# EAGLE schematic USBToILDAv1 (EAGLE 9.0.1)
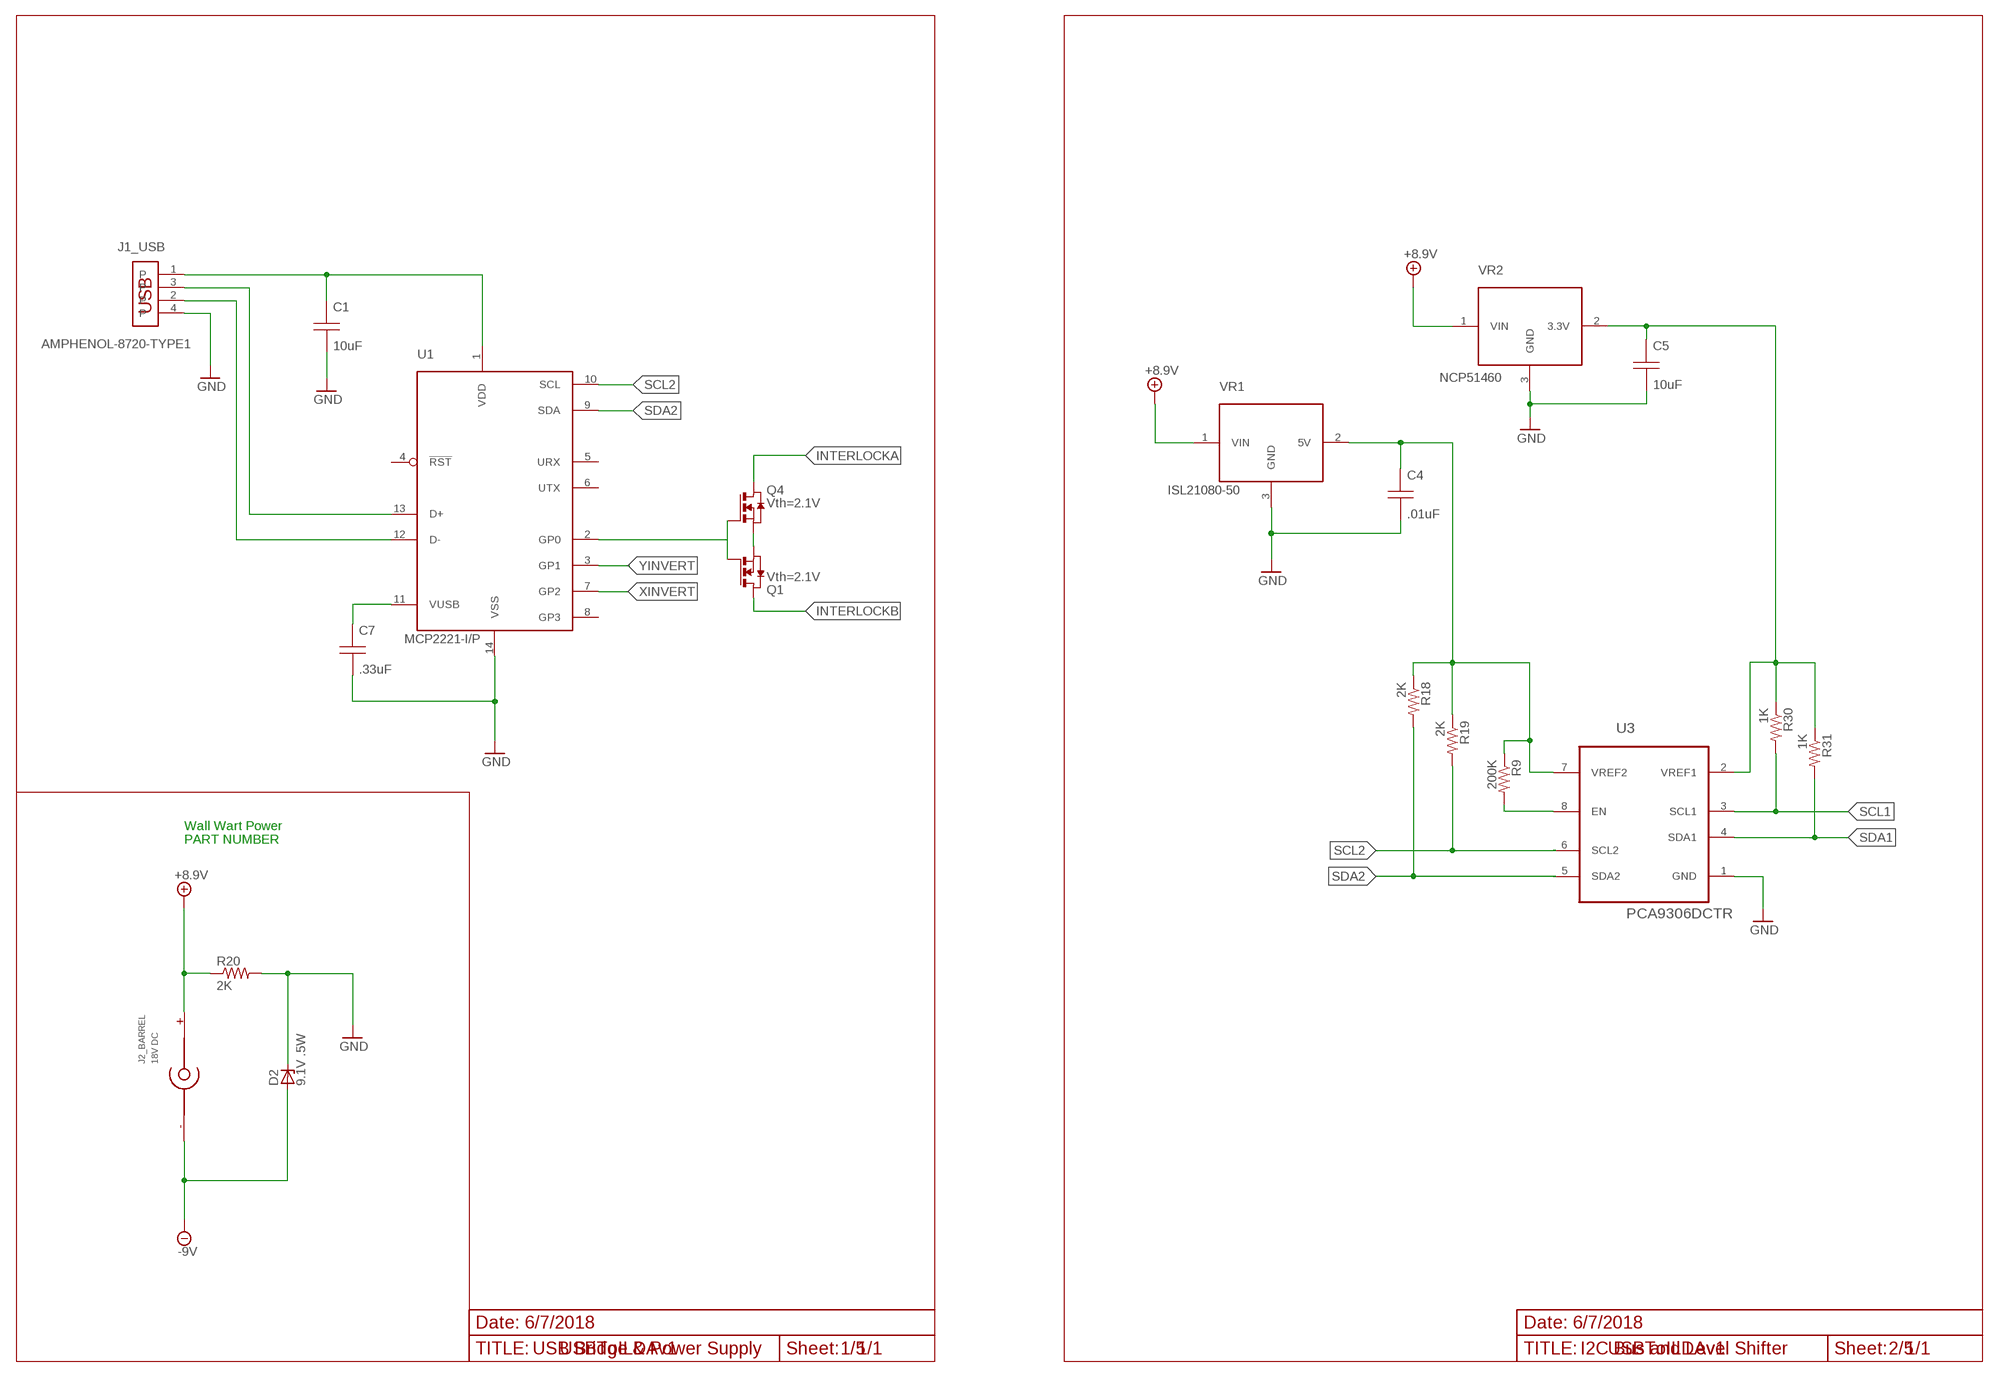
[diagram p0: schematic, sheet 1, part 1 of 3]
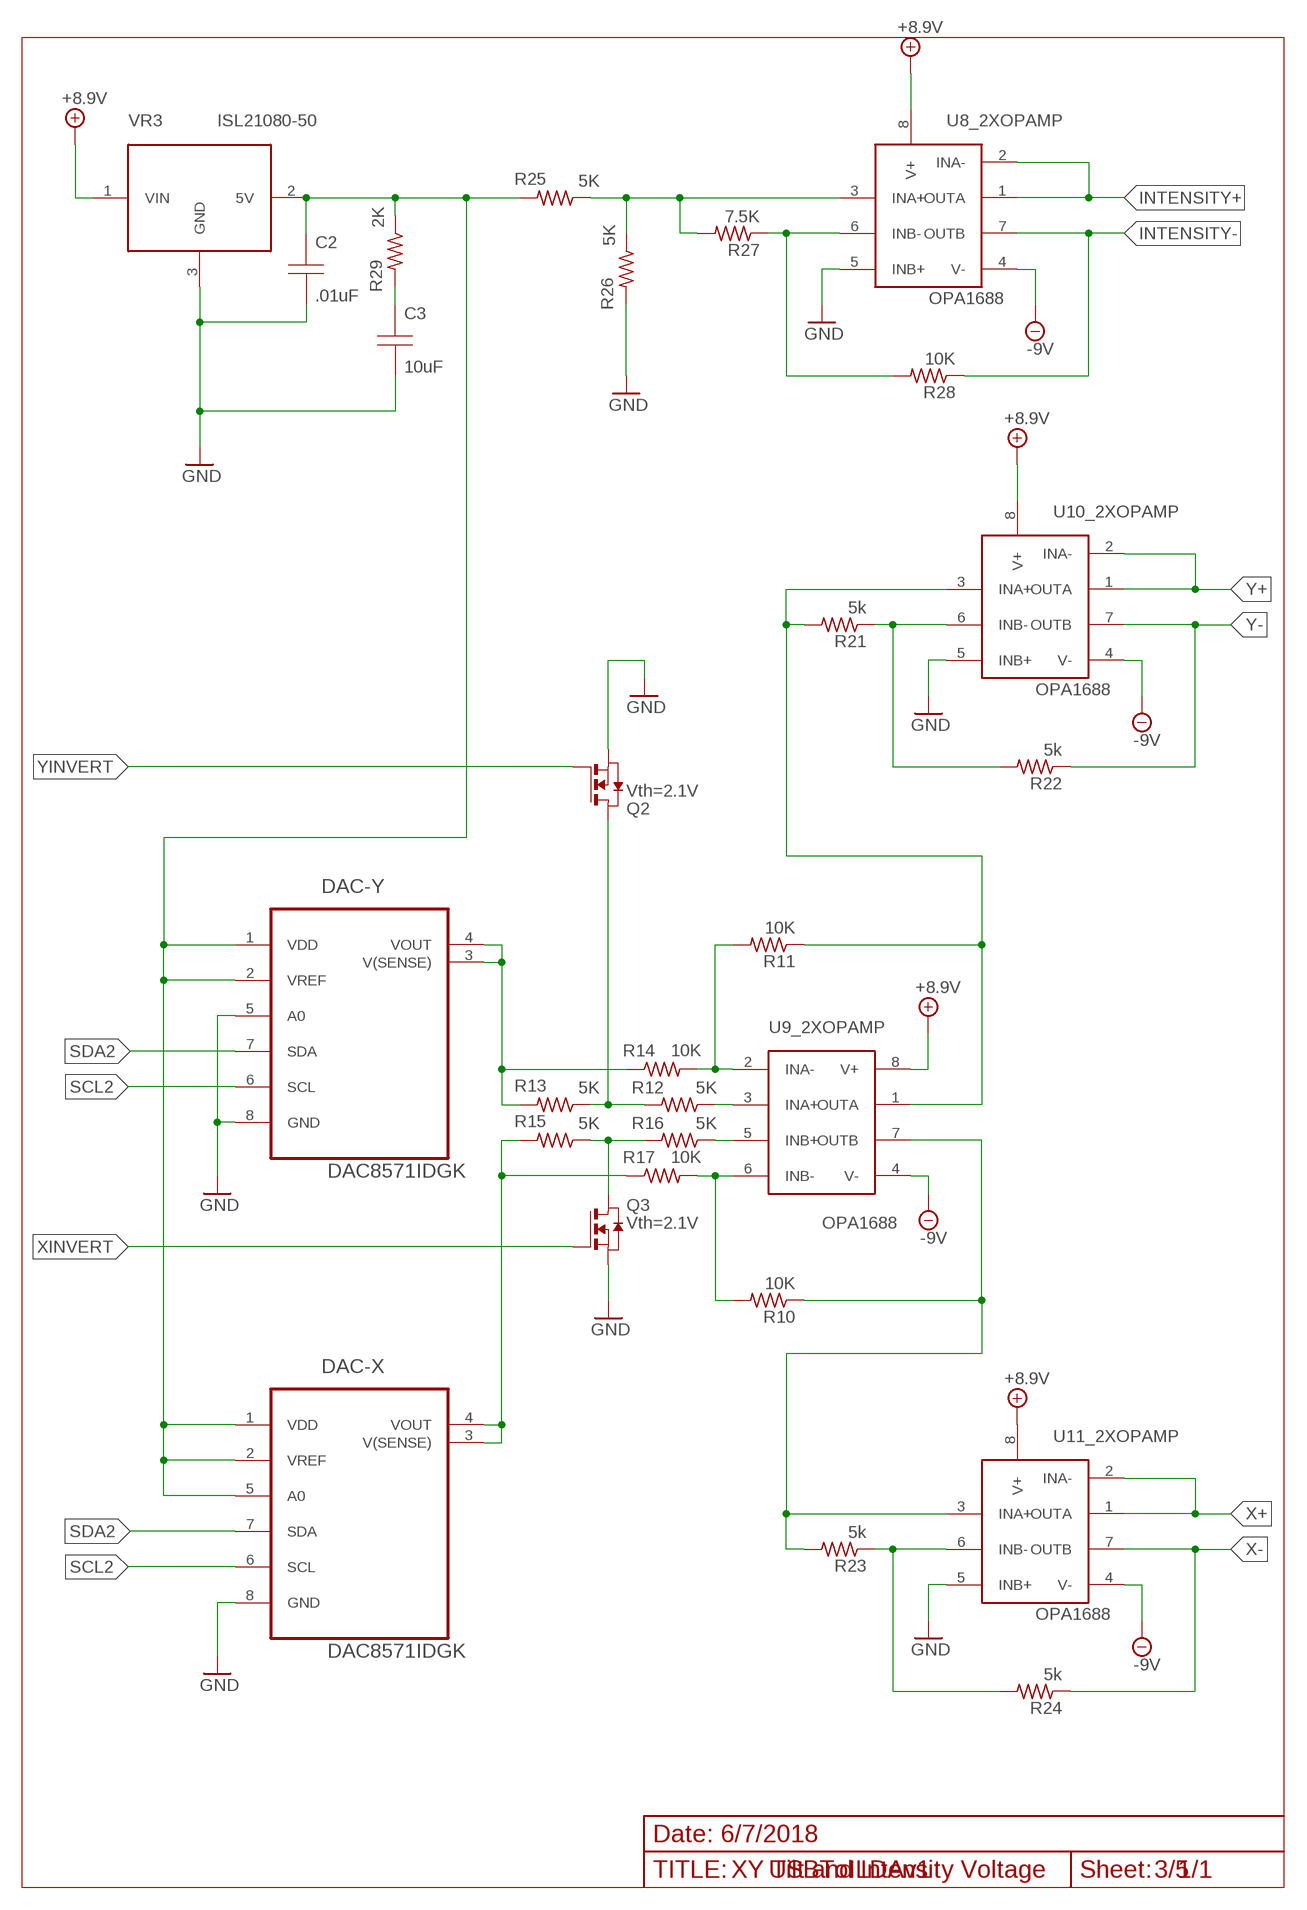
[diagram p1: schematic, sheet 1, part 2 of 3]
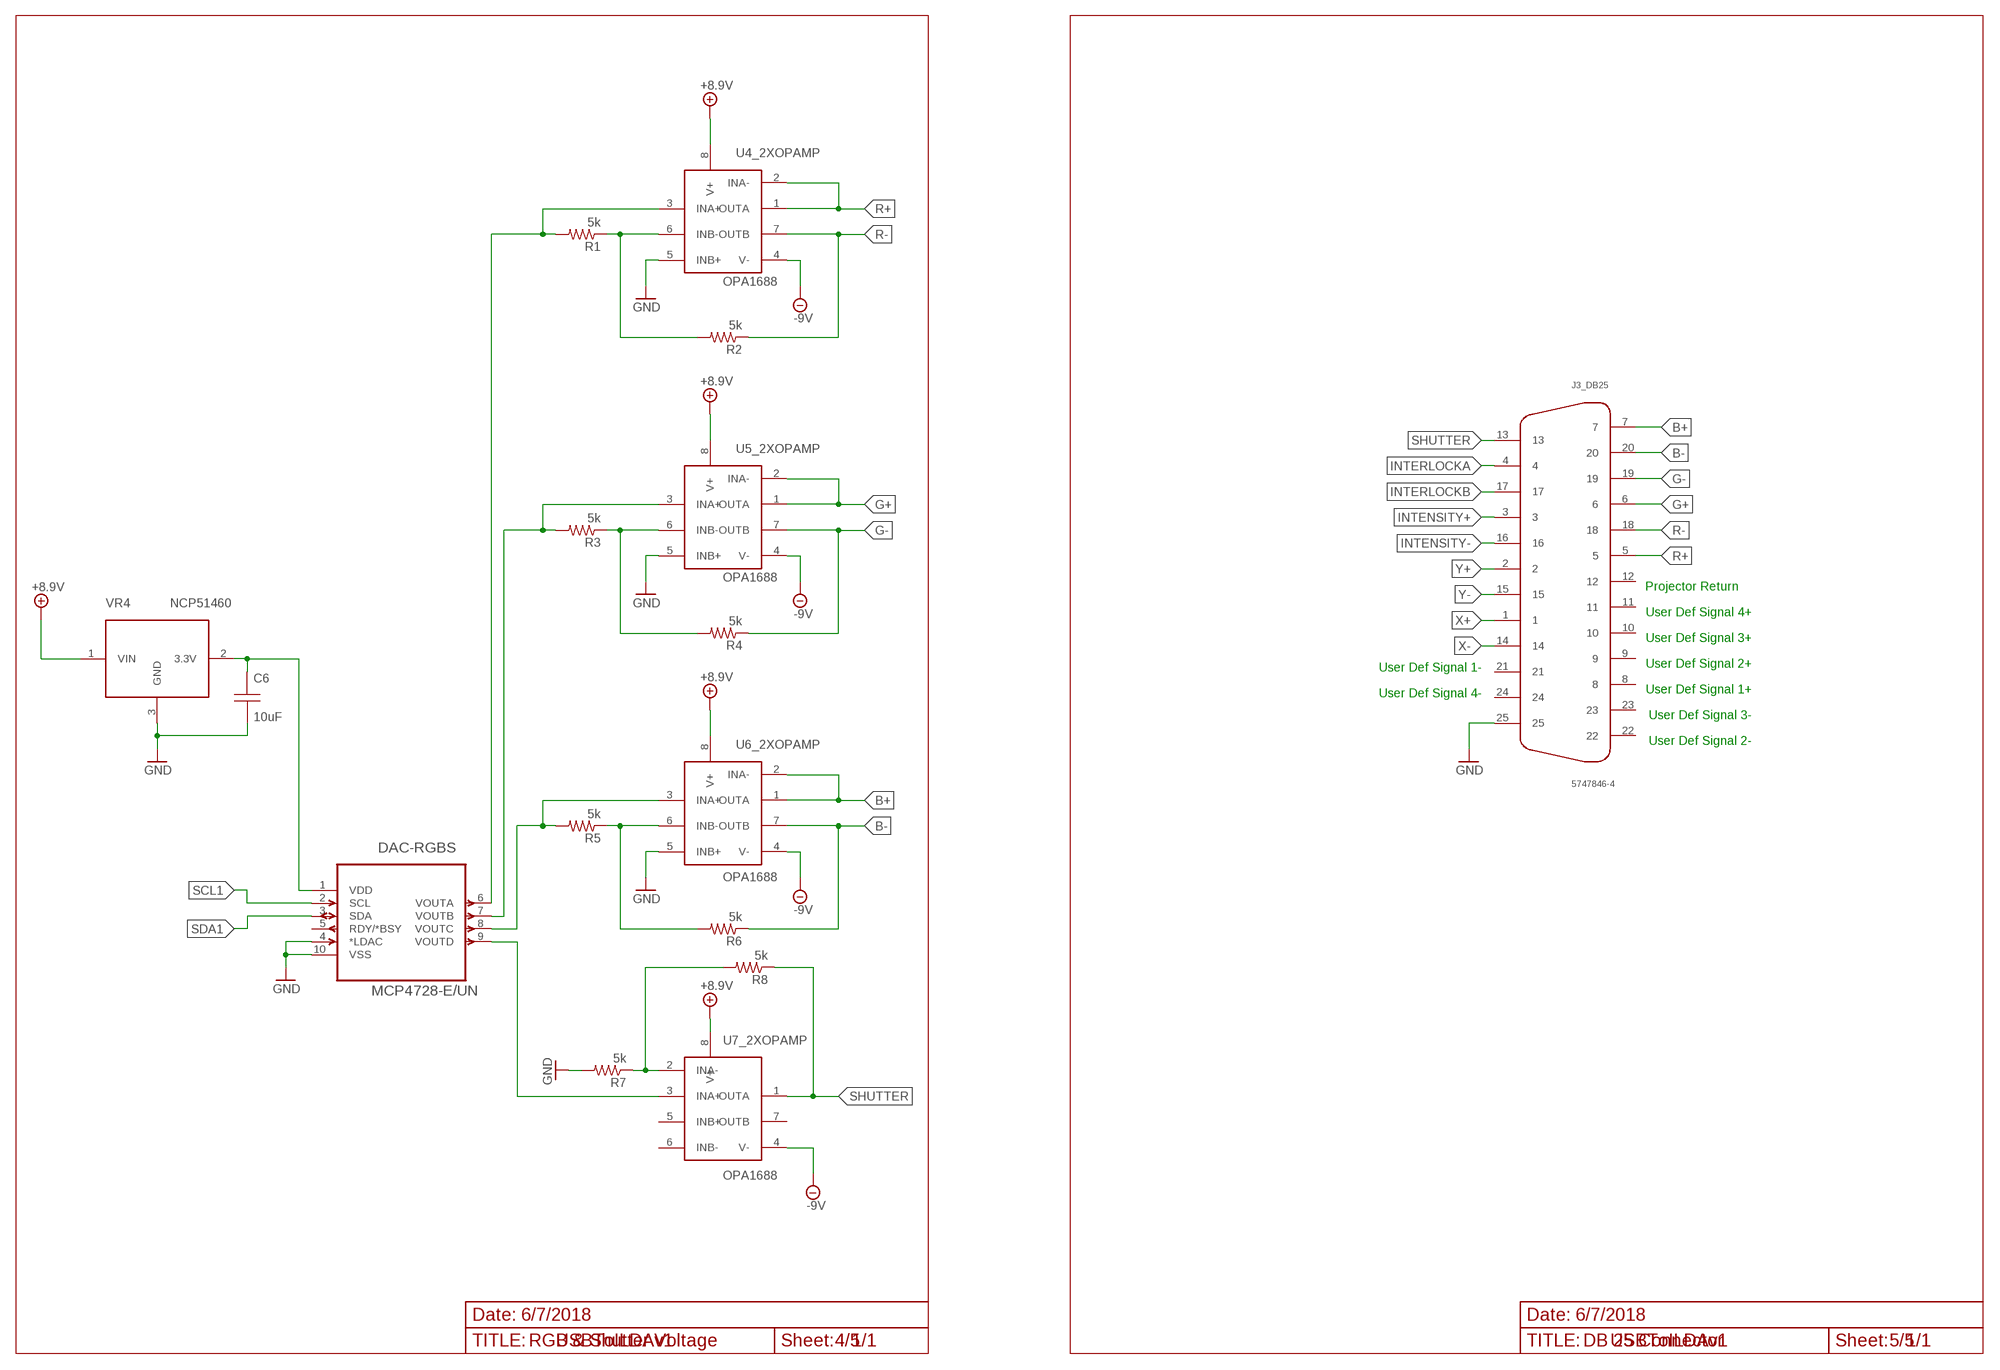
[diagram p2: schematic, sheet 1, part 3 of 3]

## Parts
C1  10uF  RCER71H106MWM1H03A  [WM1]
C2  .01uF  RCER71H106MWM1H03A  [WM1]
C3  10uF  RCER71H106MWM1H03A  [WM1]
C4  .01uF  RCER71H106MWM1H03A  [WM1]
C5  10uF  RCER71H106MWM1H03A  [WM1]
C6  10uF  RCER71H106MWM1H03A  [WM1]
C7  .33uF  RCER71H106MWM1H03A  [WM1]
D2  9.1V .5W  ZPD  [DO35Z10]
DAC-RGBS  MCP4728-E/UN  [SOP50P490X110-10N]
DAC-X  DAC8571IDGK  [SOP65P490X110-8N]
DAC-Y  DAC8571IDGK  [SOP65P490X110-8N]
J1_  AMPHENOL-8720-TYPE1  [87520]
J2_BARREL  18V DC  WSU180-0660  [PJ-036AH-SMT-TR]
J3_  5747846-4  [5747846-4]
Q1  Vth=2.1V  DMN3033LDM  [SOT-26]
Q2  Vth=2.1V  DMN3033LDM  [SOT-26]
Q3  Vth=2.1V  DMN3033LDM  [SOT-26]
Q4  Vth=2.1V  DMN3033LDM  [SOT-26]
R1  5k  R-US_01005  [R01005]
R2  5k  R-US_01005  [R01005]
R3  5k  R-US_01005  [R01005]
R4  5k  R-US_01005  [R01005]
R5  5k  R-US_01005  [R01005]
R6  5k  R-US_01005  [R01005]
R7  5k  R-US_01005  [R01005]
R8  5k  R-US_01005  [R01005]
R9  200K  R-US_01005  [R01005]
R10  10K  R-US_01005  [R01005]
R11  10K  R-US_01005  [R01005]
R12  5K  R-US_01005  [R01005]
R13  5K  R-US_01005  [R01005]
R14  10K  R-US_01005  [R01005]
R15  5K  R-US_01005  [R01005]
R16  5K  R-US_01005  [R01005]
R17  10K  R-US_01005  [R01005]
R18  2K  R-US_01005  [R01005]
R19  2K  R-US_01005  [R01005]
R20  2K  R-US_01005  [R01005]
R21  5k  R-US_01005  [R01005]
R22  5k  R-US_01005  [R01005]
R23  5k  R-US_01005  [R01005]
R24  5k  R-US_01005  [R01005]
R25  5K  R-US_01005  [R01005]
R26  5K  R-US_01005  [R01005]
R27  7.5K  R-US_01005  [R01005]
R28  10K  R-US_01005  [R01005]
R29  2K  R-US_01005  [R01005]
R30  1K  R-US_01005  [R01005]
R31  1K  R-US_01005  [R01005]
U1  MCP2221-I/P  [DIL14]
U3  PCA9306DCTR  [SOP65P400X130-8N]
U4  OPA1688  [SOIC-8]
U5  OPA1688  [SOIC-8]
U6  OPA1688  [SOIC-8]
U7  OPA1688  [SOIC-8]
U8  OPA1688  [SOIC-8]
U9  OPA1688  [SOIC-8]
U10  OPA1688  [SOIC-8]
U11  OPA1688  [SOIC-8]
VR1  ISL21080-50  [SOT23-CASE308]
VR2  NCP51460  [SOT-23-CASE318]
VR3  ISL21080-50  [SOT23-CASE308]
VR4  NCP51460  [SOT-23-CASE318]

## Nets
+8.9V: J2_BARREL.1(+) R20.1 U4.8(8:V+) U5.8(8:V+) U6.8(8:V+) U7.8(8:V+) U8.8(8:V+) U9.8(8:V+) U10.8(8:V+) U11.8(8:V+) VR1.1(VIN) VR2.1(VIN) VR3.1(VIN) VR4.1(VIN)
-9V: D2.A J2_BARREL.2(-) J2_BARREL.3(-) U4.4(4:V-) U5.4(4:V-) U6.4(4:V-) U7.4(4:V-) U8.4(4:V-) U9.4(4:V-) U10.4(4:V-) U11.4(4:V-)
B+: J3_.7 U6.1(1:OUTA) U6.2(2:INA-)
B-: J3_.20 R6.1 U6.7(7:OUTB)
G+: J3_.6 U5.1(1:OUTA) U5.2(2:INA-)
G-: J3_.19 R4.1 U5.7(7:OUTB)
GND: C2.P$2(B) C3.P$2(B) C4.P$2(B) C5.P$2(B) C6.P$2(B) C7.P$2(B) D2.C DAC-RGBS.4(*LDAC) DAC-RGBS.10(VSS) DAC-X.8(GND) DAC-Y.5(A0) DAC-Y.8(GND) J1_.4(4:P) J3_.25 Q2.S Q3.S R7.2 R20.2 R26.2 U1.14(VSS) U3.1(GND) U4.5(5:INB+) U5.5(5:INB+) U6.5(5:INB+) U8.5(5:INB+) U10.5(5:INB+) U11.5(5:INB+) VR1.3(GND) VR2.3(GND) VR3.3(GND) VR4.3(GND)
INTENSITY+: J3_.3 U8.1(1:OUTA) U8.2(2:INA-)
INTENSITY-: J3_.16 R28.1 U8.7(7:OUTB)
INTERLOCK-I/O: Q1.G Q4.G U1.2(GP0)
INTERLOCKA: J3_.4 Q4.D1(D) Q4.D2(D) Q4.D3(D) Q4.D4(D)
INTERLOCKB: J3_.17 Q1.D1(D) Q1.D2(D) Q1.D3(D) Q1.D4(D)
N$1: C1.P$2(B) ; supply symbol labelled GND
N$2: J1_.2(2:P) U1.12(D-)
N$3: J1_.3(3:P) U1.13(D+)
N$4: C1.P$1(A) J1_.1(1:P) U1.1(VDD)
N$5: R9.2 U3.8(EN)
N$6: DAC-RGBS.6(VOUTA) R1.2 U4.3(3:INA+)
N$7: R7.1 R8.2 U7.2(2:INA-)
N$8: R1.1 R2.2 U4.6(6:INB-)
N$9: C6.P$1(A) DAC-RGBS.1(VDD) VR4.2(3.3V)
N$10: DAC-RGBS.7(VOUTB) R3.2 U5.3(3:INA+)
N$11: R25.1 R26.1 R27.2 U8.3(3:INA+)
N$12: R3.1 R4.2 U5.6(6:INB-)
N$13: C2.P$1(A) DAC-X.1(VDD) DAC-X.2(VREF) DAC-X.5(A0) DAC-Y.1(VDD) DAC-Y.2(VREF) R25.2 R29.1 VR3.2(5V)
N$14: DAC-RGBS.8(VOUTC) R5.2 U6.3(3:INA+)
N$15: R11.1 R21.2 U9.1(1:OUTA) U10.3(3:INA+)
N$16: R5.1 R6.2 U6.6(6:INB-)
N$17: C7.P$1(A) U1.11(VUSB)
N$18: DAC-RGBS.9(VOUTD) U7.3(3:INA+)
N$22: C4.P$1(A) R9.1 R18.1 R19.1 U3.7(VREF2) VR1.2(5V)
N$23: Q1.S Q4.S
N$28: R11.2 R14.2 U9.2(2:INA-)
N$30: R12.1 U9.3(3:INA+)
N$31: Q2.D1(D) Q2.D2(D) Q2.D3(D) Q2.D4(D) R12.2 R13.1
N$32: DAC-Y.3(V(SENSE)) DAC-Y.4(VOUT) R13.2 R14.1
N$33: DAC-X.3(V(SENSE)) DAC-X.4(VOUT) R15.2 R17.1
N$35: Q3.D1(D) Q3.D2(D) Q3.D3(D) Q3.D4(D) R15.1 R16.2
N$36: R16.1 U9.5(5:INB+)
N$37: R10.2 R17.2 U9.6(6:INB-)
N$38: R10.1 R23.2 U9.7(7:OUTB) U11.3(3:INA+)
N$43: C3.P$1(A) R29.2
N$45: R21.1 R22.2 U10.6(6:INB-)
N$48: R23.1 R24.2 U11.6(6:INB-)
N$51: R27.1 R28.2 U8.6(6:INB-)
N$54: C5.P$1(A) R30.1 R31.1 U3.2(VREF1) VR2.2(3.3V)
R+: J3_.5 U4.1(1:OUTA) U4.2(2:INA-)
R-: J3_.18 R2.1 U4.7(7:OUTB)
SCL1: DAC-RGBS.2(SCL) R30.2 U3.3(SCL1)
SCL2: DAC-X.6(SCL) DAC-Y.6(SCL) R19.2 U1.10(SCL) U3.6(SCL2)
SDA1: DAC-RGBS.3(SDA) R31.2 U3.4(SDA1)
SDA2: DAC-X.7(SDA) DAC-Y.7(SDA) R18.2 U1.9(SDA) U3.5(SDA2)
SHUTTER: J3_.13 R8.1 U7.1(1:OUTA)
X+: J3_.1 U11.1(1:OUTA) U11.2(2:INA-)
X-: J3_.14 R24.1 U11.7(7:OUTB)
XINVERT: Q3.G U1.7(GP2)
Y+: J3_.2 U10.1(1:OUTA) U10.2(2:INA-)
Y-: J3_.15 R22.1 U10.7(7:OUTB)
YINVERT: Q2.G U1.3(GP1)
Unconnected: DAC-RGBS.5(RDY/*BSY) J3_.8 J3_.9 J3_.10 J3_.11 J3_.12 J3_.21 J3_.22 J3_.23 J3_.24 U1.4(!RST) U1.5(URX) U1.6(UTX) U1.8(GP3) U7.5(5:INB+) U7.6(6:INB-) U7.7(7:OUTB)

## Notes on the sheet
- Projector Return
- User Def Signal 4+
- User Def Signal 3+
- User Def Signal 2+
- User Def Signal 1-
- User Def Signal 1+
- User Def Signal 4-
- User Def Signal 3-
- User Def Signal 2-
- Wall Wart Power 
  PART NUMBER
- 6/7/2018 | 6/7/2018 | 6/7/2018 | 6/7/2018 | 6/7/2018
- USB Bridge & Power Supply | 1/5 | I2C Bus and Level Shifter | 2/5 | XY Tilt and Intensity Voltage | 3/5 | RGB & Shutter Voltage | 4/5 | DB 25 Connector | 5/5

## Library data of the parts
C1-C7 = Capacitors:RCER71H106MWM1H03A
D2 = diode:ZPD: Z DIODE 500 mW
DAC-RGBS = Microchip_By_element14_Batch_1:MCP4728-E/UN: IC, DAC, 12BIT, QUAD; MPN: MCP4728-E/UN; OC_FARNELL: 1800217; OC_NEWARK: 08R1808; PACKAGE: MSOP-10; SUPPLIER: MICROCHIP
DAC-X DAC-Y = Texas Instruments_By_element14_Batch_1:DAC8571IDGK: 0.05ìV/°C max, SINGLE-SUPPLY CMOS OPERATIONAL AMPLIFIERS Zer.-Drift Series; MPN: DAC8571IDGK; OC_FARNELL: -; OC_NEWARK: 20H5068; PACKAGE: MSOP-8; SUPPLIER: Texas Instruments
J1_ = USB Connectors:AMPHENOL-8720-TYPE1
J2_BARREL = CUI:WSU180-0660
J3_ = DB Connectors:5747846-4
Q1-Q4 = DIODES:DMN3033LDM
R1-R31 = resistor:R-US_: RESISTOR, American symbol
U1 = microchip-mcp2221:MCP2221-*: MCP2221 in PDIP, SOIC and TSSOP package The MCP2221 is a USB-to-UART/I2C serial converter which enables USB connectivity in applications that have a UART and I2C interfaces. The device reduces external components by integrating the USB termination resistors and the oscillator needed for USB operation. The MCP2221 also has four GP pins providing miscellaneous functionalities (GPIO, USBCFG, SSPND, Clock Output, ADC, DAC, interrupt detector). Source: www.microchip.com/MCP2221 <http://www.microchip.com/wwwproducts/Devices.aspx?product=MCP2221> and www.microchipdirect.com <http://www.microchipdirect.com/ProductDetails.aspx?Category=MCP2221> Tutorial: MCP2221 by Arnauld Biganzoli <https://docs.google.com/document/d/1P3zzqCKdEXzCe--1Yyg8PClCZKsUri8pyNO7AV2daaw/edit?usp=sharing>
U3 = Texas Instruments_By_element14_Batch_1:PCA9306DCTR: VOLTAGE-LEVEL TRANSLATOR; MPN: PCA9306DCTR; OC_FARNELL: 1470936; OC_NEWARK: 65J6232; PACKAGE: SOP-8; SUPPLIER: TEXAS INSTRUMENTS
U4-U11 = TI:OPA1688
VR1 VR3 = RENESIS:ISL21080-50
VR2 VR4 = ONSemiconductors:NCP51460